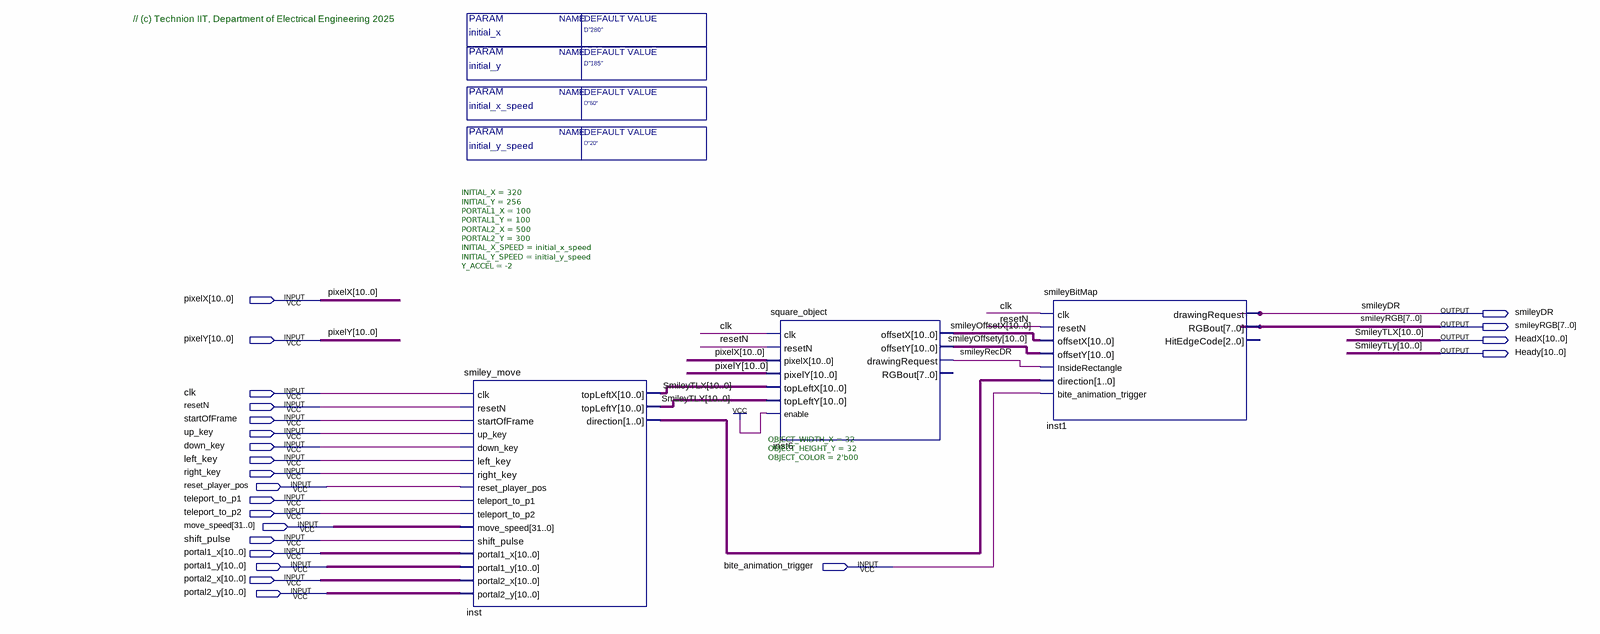
[diagram p0: schematic sheet]
// Quartus schematic Smiley_Block_T.bdf as structural Verilog: 3 symbols, 23 pins
module Smiley_Block_T #(parameter initial_x = "D\"280\"", parameter initial_y = "D\"185\"", parameter initial_x_speed = "D\"60\"", parameter initial_y_speed = "D\"20\"") (
  input  [10:0] pixelX,
  input  [10:0] pixelY,
  input  clk,
  input  resetN,
  input  startOfFrame,
  input  up_key,
  input  down_key,
  input  left_key,
  input  right_key,
  input  reset_player_pos,
  input  teleport_to_p1,
  input  teleport_to_p2,
  input  [31:0] move_speed,
  input  shift_pulse,
  input  [10:0] portal1_x,
  input  [10:0] portal1_y,
  input  bite_animation_trigger,
  input  [10:0] portal2_x,
  input  [10:0] portal2_y,
  output smileyDR,
  output [7:0] smileyRGB,
  output [10:0] HeadX,
  output [10:0] Heady
);

  wire smileyRecDR;
  wire [1:0] inst_direction;
  wire [10:0] smileyOffsetX, smileyOffsety;

  smiley_move #(.INITIAL_X(320), .INITIAL_Y(256), .PORTAL1_X(100), .PORTAL1_Y(100), .PORTAL2_X(500), .PORTAL2_Y(300), .INITIAL_X_SPEED(initial_x_speed), .INITIAL_Y_SPEED(initial_y_speed), .Y_ACCEL(-2)) inst (
    .clk(clk), .resetN(resetN), .startOfFrame(startOfFrame), .up_key(up_key), .down_key(down_key),
    .left_key(left_key), .right_key(right_key), .reset_player_pos(reset_player_pos),
    .teleport_to_p1(teleport_to_p1), .teleport_to_p2(teleport_to_p2), .move_speed(move_speed),
    .shift_pulse(shift_pulse), .portal1_x(portal1_x), .portal1_y(portal1_y), .portal2_x(portal2_x),
    .portal2_y(portal2_y), .topLeftX(HeadX), .topLeftY(Heady), .direction(inst_direction));
  square_object #(.OBJECT_WIDTH_X(32), .OBJECT_HEIGHT_Y(32), .OBJECT_COLOR(2'b00)) inst6 (
    .clk(clk), .resetN(resetN), .pixelX(pixelX), .pixelY(pixelY), .topLeftX(HeadX), .topLeftY(Heady),
    .enable(1'b1), .offsetX(smileyOffsetX), .offsetY(smileyOffsety), .drawingRequest(smileyRecDR));  // open: RGBout
  smileyBitMap inst1 (
    .clk(clk), .resetN(resetN), .offsetX(smileyOffsetX), .offsetY(smileyOffsety),
    .InsideRectangle(smileyRecDR), .direction(inst_direction),
    .bite_animation_trigger(bite_animation_trigger), .drawingRequest(smileyDR), .RGBout(smileyRGB));  // open: HitEdgeCode

  // Other names for the same wires on the sheet: SmileyTLX[10:0] = HeadX; SmileyTLy[10:0] = Heady

  // Notes on the sheet:
  //   // (c) Technion IIT, Department of Electrical Engineering 2025
endmodule
